# Altium schematic sheet LM-CT-001.SchDoc
size Tabloid
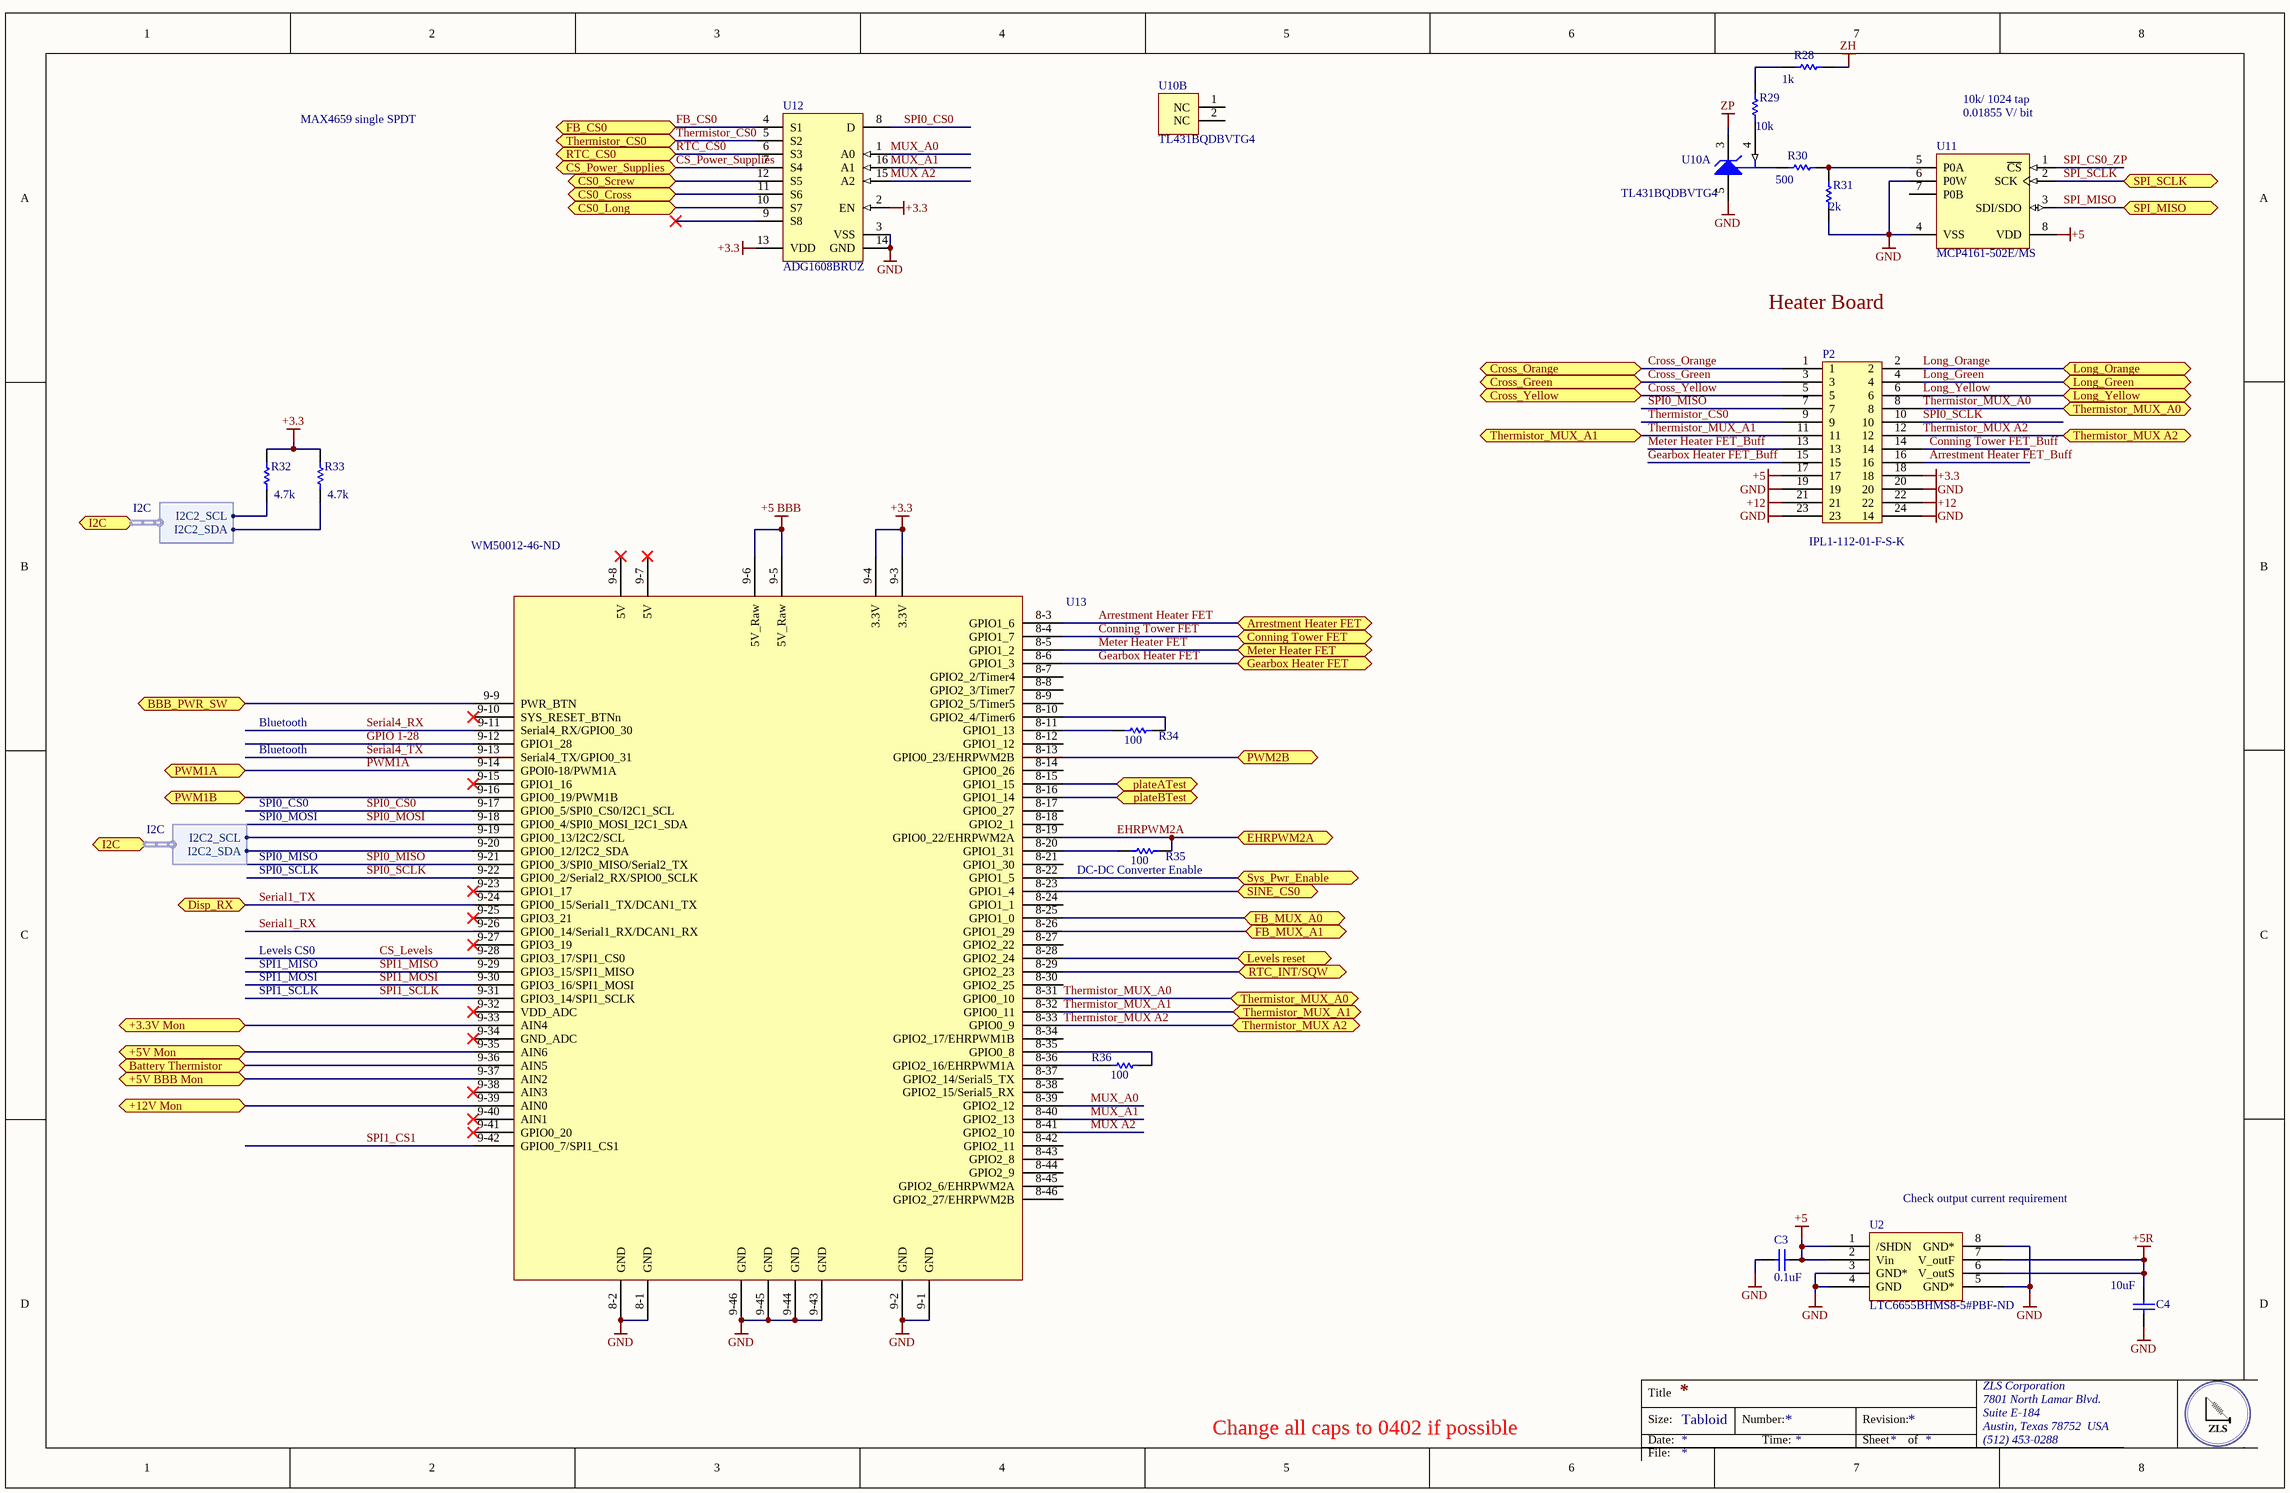
[diagram p0: LM-CT-001.SchDoc]

## Parts
C3  0.1uF  [CAPC0402(1005)60_L]
C4  value 10uF  [CAPC1812(4532)250_N]  (hidden comment: CAP FILM 10UF 20% 16VDC 1812)
P2  IPL1-112-01-F-S-K  [IPL1-112-01-F-S-K]
R28  1k  [RESC0402(1005)_M]
R29  10k  [RESC0402(1005)_M]
R30  500  [RESC0402(1005)_M]
R31  2k  [RESC0402(1005)_M]
R32  4.7k  [RESC0402(1005)_M]
R33  4.7k  [RESC0402(1005)_M]
R34  100  [RESC0402(1005)_M]
R35  100  [RESC0402(1005)_M]
R36  100  [RESC0402(1005)_M]
U2  Supplier Part Number 1: LTC6655BHMS8-5#PBF-ND  [TSOP65P490X110-8N]  (hidden comment: LTC6655BHMS8-5#PBF)
U10  TL431BQDBVTG4  [TI-DBV5_N]  (parts A,B of 2)
U11  MCP4161-502E/MS  [MSOP-MS8_N]
U12  ADG1608BRUZ  [ADI-RU-16_M]
U13  Supplier Part Number 1: WM50012-46-ND  [Beaglebone Black]  (hidden comment: BBB)

## Ports
+3.3V Mon, +5V BBB Mon, +5V Mon, +12V Mon, Arrestment Heater FET, Battery Thermistor, BBB_PWR_SW, Conning Tower FET, Cross_Green, Cross_Orange, Cross_Yellow, CS0_Cross, CS0_Long, CS0_Screw, CS_Power_Supplies, Disp_RX, EHRPWM2A, FB_CS0, FB_MUX_A0, FB_MUX_A1, Gearbox Heater FET, I2C (harness I2C), Levels reset, Long_Green, Long_Orange, Long_Yellow, Meter Heater FET, plateATest, plateBTest, PWM1A, PWM1B, PWM2B, RTC_CS0, RTC_INT/SQW, SINE_CS0, SPI_MISO, SPI_SCLK, Sys_Pwr_Enable, Thermistor_CS0, Thermistor_MUX A2, Thermistor_MUX_A0, Thermistor_MUX_A1

## Harnesses
I2C: I2C2_SDA, I2C2_SCL

## Nets
+3.3: P2.18 R32.1 R33.1 U12.2(EN) U12.13(VDD) U13.9-3(3.3V) U13.9-4(3.3V)
+5: C3.2 P2.17 U2.1(/SHDN) U2.2(Vin) U11.8(VDD)
+5 BBB: U13.9-5(5V_Raw) U13.9-6(5V_Raw)
+5R: C4.2 U2.6(V_outS) U2.7(V_outF)
+12: P2.21 P2.22
GND: C3.1 C4.1 P2.19 P2.20 P2.23 P2.24(14) R31.2 U2.3(GND*) U2.4(GND) U2.5(GND*) U2.8(GND*) U10.5(ANODE) U11.4(VSS) U11.6(P0W) U12.3(VSS) U12.14(GND) U13.8-1(GND) U13.8-2(GND) U13.9-1(GND) U13.9-2(GND) U13.9-43(GND) U13.9-44(GND) U13.9-45(GND) U13.9-46(GND)
ZH: R28.2
ZP: U10.3(CATHODE)
+3.3V Mon: U13.9-33(AIN4) ; port +3.3V Mon
+5V BBB Mon: U13.9-37(AIN2) ; port +5V BBB Mon
+5V Mon: U13.9-35(AIN6) ; port +5V Mon
+12V Mon: U13.9-39(AIN0) ; port +12V Mon
Arrestment Heater FET: U13.8-3(GPIO1_6) ; port Arrestment Heater FET
Arrestment Heater FET_Buff: P2.16
Battery Thermistor: U13.9-36(AIN5) ; port Battery Thermistor
BBB_PWR_SW: U13.9-9(PWR_BTN) ; port BBB_PWR_SW
Conning Tower FET: U13.8-4(GPIO1_7) ; port Conning Tower FET
Conning Tower FET_Buff: P2.14
Cross_Green: P2.3 ; port Cross_Green
Cross_Orange: P2.1 ; port Cross_Orange
Cross_Yellow: P2.5 ; port Cross_Yellow
CS0_Cross: U12.11(S6) ; port CS0_Cross
CS0_Long: U12.10(S7) ; port CS0_Long
CS0_Screw: U12.12(S5) ; port CS0_Screw
CS_Levels: U13.9-28(GPIO3_17/SPI1_CS0)
CS_Power_Supplies: U12.7(S4) ; port CS_Power_Supplies
EHRPWM2A: R35.2 U13.8-19(GPIO0_22/EHRPWM2A) ; port EHRPWM2A
FB_CS0: U12.4(S1) ; port FB_CS0
FB_MUX_A0: U13.8-25(GPIO1_0) ; port FB_MUX_A0
FB_MUX_A1: U13.8-26(GPIO1_29) ; port FB_MUX_A1
Gearbox Heater FET: U13.8-6(GPIO1_3) ; port Gearbox Heater FET
Gearbox Heater FET_Buff: P2.15
GPIO 1-28: U13.9-12(GPIO1_28)
Levels reset: U13.8-28(GPIO2_24) ; port Levels reset
Long_Green: P2.4 ; port Long_Green
Long_Orange: P2.2 ; port Long_Orange
Long_Yellow: P2.6 ; port Long_Yellow
Meter Heater FET: U13.8-5(GPIO1_2) ; port Meter Heater FET
Meter Heater FET_Buff: P2.13
MUX A2: U12.15(A2) U13.8-41(GPIO2_10)
MUX_A0: U12.1(A0) U13.8-39(GPIO2_12)
MUX_A1: U12.16(A1) U13.8-40(GPIO2_13)
plateATest: U13.8-15(GPIO1_15) ; port plateATest
plateBTest: U13.8-16(GPIO1_14) ; port plateBTest
PWM1A: U13.9-14(GPOI0-18/PWM1A) ; port PWM1A
PWM1B: U13.9-16(GPIO0_19/PWM1B) ; port PWM1B
PWM2B: U13.8-13(GPIO0_23/EHRPWM2B) ; port PWM2B
RTC_CS0: U12.6(S3) ; port RTC_CS0
RTC_INT/SQW: U13.8-29(GPIO2_23) ; port RTC_INT/SQW
Serial1_RX: U13.9-26(GPIO0_14/Serial1_RX/DCAN1_RX)
Serial1_TX: U13.9-24(GPIO0_15/Serial1_TX/DCAN1_TX) ; port Disp_RX
Serial4_RX: U13.9-11(Serial4_RX/GPIO0_30)
Serial4_TX: U13.9-13(Serial4_TX/GPIO0_31)
SINE_CS0: U13.8-23(GPIO1_4) ; port SINE_CS0
SPI0_CS0: U12.8(D) U13.9-17(GPIO0_5/SPI0_CS0/I2C1_SCL)
SPI0_MISO: P2.7 U13.9-21(GPIO0_3/SPI0_MISO/Serial2_TX)
SPI0_MOSI: U13.9-18(GPIO0_4/SPI0_MOSI_I2C1_SDA)
SPI0_SCLK: P2.10 U13.9-22(GPIO0_2/Serial2_RX/SPIO0_SCLK)
SPI1_CS1: U13.9-42(GPIO0_7/SPI1_CS1)
SPI1_MISO: U13.9-29(GPIO3_15/SPI1_MISO)
SPI1_MOSI: U13.9-30(GPIO3_16/SPI1_MOSI)
SPI1_SCLK: U13.9-31(GPIO3_14/SPI1_SCLK)
SPI_CS0_ZP: U11.1(~{CS})
SPI_MISO: U11.3(SDI/SDO) ; port SPI_MISO
SPI_SCLK: U11.2(SCK) ; port SPI_SCLK
Sys_Pwr_Enable: U13.8-22(GPIO1_5) ; port Sys_Pwr_Enable
Thermistor_CS0: P2.9 U12.5(S2) ; port Thermistor_CS0
Thermistor_MUX A2: P2.12 U13.8-33(GPIO0_9) ; port Thermistor_MUX A2
Thermistor_MUX_A0: P2.8 U13.8-31(GPIO0_10) ; port Thermistor_MUX_A0
Thermistor_MUX_A1: P2.11 U13.8-32(GPIO0_11) ; port Thermistor_MUX_A1
NetR28_1: R28.1 R29.1
NetR29_2: R29.2 U10.4(REF)
NetR30_2: R30.2 R31.1 U11.5(P0A)
NetR32_2: R32.2 U13.9-19(GPIO0_13/I2C2/SCL) ; port I2C.I2C2_SCL
NetR33_2: R33.2 U13.9-20(GPIO0_12/I2C2_SDA) ; port I2C.I2C2_SDA
NetR34_1: R34.1 U13.8-11(GPIO1_13)
NetR34_2: R34.2 U13.8-10(GPIO2_4/Timer6)
NetR35_1: R35.1 U13.8-20(GPIO1_31)
NetR36_1: R36.1 U13.8-36(GPIO2_16/EHRPWM1A)
NetR36_2: R36.2 U13.8-35(GPIO0_8)

Not connected (* = marked no-connect by the designer): R30 1; U10 1(NC) 2(NC); U11 7(P0B); U12 9(S8)*; U13 8-7(GPIO2_2/Timer4) 8-8(GPIO2_3/Timer7) 8-9(GPIO2_5/Timer5) 8-12(GPIO1_12) 8-14(GPIO0_26) 8-17(GPIO0_27) 8-18(GPIO2_1) 8-21(GPIO1_30) 8-24(GPIO1_1) 8-27(GPIO2_22) 8-30(GPIO2_25) 8-34(GPIO2_17/EHRPWM1B) 8-37(GPIO2_14/Serial5_TX) 8-38(GPIO2_15/Serial5_RX) 8-42(GPIO2_11) 8-43(GPIO2_8) 8-44(GPIO2_9) 8-45(GPIO2_6/EHRPWM2A) 8-46(GPIO2_27/EHRPWM2B) 9-7(5V)* 9-8(5V)* 9-10(SYS_RESET_BTNn)* 9-15(GPIO1_16)* 9-23(GPIO1_17)* 9-25(GPIO3_21)* 9-27(GPIO3_19)* 9-32(VDD_ADC)* 9-34(GND_ADC)* 9-38(AIN3)* 9-40(AIN1)* 9-41(GPIO0_20)*

## Notes on the sheet
- 10k/ 1024 tap
- MAX4659 single SPDT
- (near U11) 0.01855 V/ bit
- Heater Board
- Bluetooth
- SPI0_CS0
- SPI0_MOSI
- SPI0_MISO
- SPI0_SCLK
- (near R35) DC-DC Converter Enable
- SPI1_MISO
- Levels CS0
- SPI1_MOSI
- SPI1_SCLK
- (near U2) Check output current requirement
- Change all caps to 0402 if possible
- Title
- Size:
- Date:
- Tabloid
- Number:
- Time:
- Revision:
- Sheet
- of
- ZLS Corporation
- 7801 North Lamar Blvd.
- Suite E-184
- Austin, Texas 78752  USA
- (512) 453-0288
- File:

## Library data of the parts
C3 = CMP-1034-00252-1: CAP CER 0.1UF 10V X7R 0402; Manufacturer: Murata Electronics North America; Manufacturer Part Number: GRM155R71A104KA01D; Tolerance: ±10%; Supplier 1: Digi-Key; Supplier Part Number 1: 490-6321-1-ND; RoHS: RoHS Compliant; Category: Capacitors; Stock 1: 2920395; Pricing 1: 1=0.1, 10=0.014, 100=0.0063, 500=0.00446, 1000=0.00351, 2500=0.00319, 5000=0.00293 (USD); Packaging: Cut Tape (CT); Part Status: Active; Voltage - Rated: 10V; Temperature Coefficient: X7R; Operating Temperature: -55°C ~ 125°C; Features: -; Ratings: -; Applications: General Purpose; Mounting Type: Surface Mount, MLCC; Package / Case: 0402 (1005 Metric); Size / Dimension: 0.039" L x 0.020" W (1.00mm x 0.50mm); Height - Seated (Max): -; Thickness (Max): 0.022" (0.55mm); Lead Spacing: -; ComponentLink1URL: http://www.murata.com/~/media/webrenewal/support/library/catalog/products/capacitor/mlcc/c02e.ashx?la=en-us; ComponentLink1Description: http://www.murata.com/~/media/webrenewal/support/library/catalog/products/capacitor/mlcc/c02e.ashx?la=en-us
C4 = CMP-1040-01653-1: Manufacturer: Rubycon; Manufacturer Part Number: 16ST106MC44532; Rated Voltage: 16 V; Case-Metric: 4532; Case-EIA: 1812; Tolerance: Â±10%; Voltage Rating - DC: 16V; Dielectric Material: Acrylic, Metallized; Technology: SMT; Max Thickness: 2.5 mm; Supplier 1: Digi-Key; Supplier Part Number 1: 1189-1792-1-ND; RoHS: RoHS Compliant; Category: Capacitors; Stock 1: 1994; Pricing 1: 1=7.05, 10=6.263, 100=5.0105 (USD); Packaging: Cut Tape (CT); Part Status: Active; Voltage Rating - AC: -; Operating Temperature: -55°C ~ 125°C; Mounting Type: Surface Mount; Package / Case: 1812 (4532 Metric); Size / Dimension: 0.177" L x 0.126" W (4.50mm x 3.20mm); Height - Seated (Max): 0.102" (2.60mm); Lead Spacing: -; Applications: DC Link, DC Filtering; Features: -; ComponentLink1URL: http://www.rubycon.co.jp/en/catalog/e_pdfs/pmlcap/e_ST.pdf; ComponentLink1Description: http://www.rubycon.co.jp/en/catalog/e_pdfs/pmlcap/e_ST.pdf
P2 = IPL1-112-01-F-S-K: IPL1-112-01-F-D-K; Manufacturer: Samtec; Number of Contacts: 12; Gender: Male; Pitch: 2.54mm; Supplier 1: Newark; Supplier Part Number 1: 08W3504; Supplier 2: Avnet; Supplier Part Number 2: IPL1-112-01-F-S-K; Manufacturer Part Number: IPL1-112-01-F-S-K; Stock 2: 0; Mount: Through Hole; Packaging: Bulk; Termination: Solder; Orientation: Straight; Radiation Hardening: No; ComponentLink1URL: https://datasheet.ciiva.com/9444/ipl1-9444389.pdf; ComponentLink1Description: https://datasheet.ciiva.com/9444/ipl1-9444389.pdf
R28-R31 = CMP-1011-00463-1
R32-R36 = CMP-1011-00651-1
U2 = LTC6655BHMS8-5#PBF: Manufacturer: Linear Technology; Reference Type: Series; Output Type: Fixed; Voltage - Output (Min/Fixed): 5V; Tolerance: ±0.025%; Temperature Coefficient: 2ppm/°C; Noise - 0.1Hz to 10Hz: 0.25ppmp-p; Voltage - Input: 5.5 V ~ 13.2 V; Current - Supply: 7.5mA; Supplier 1: Digi-Key; Manufacturer Part Number: LTC6655BHMS8-5#PBF; RoHS: RoHS Compliant; Category: Integrated Circuits (ICs); Stock 1: 872; Pricing 1: 1=12.29, 25=8.158, 100=6.7 (USD); Packaging: Tube; Part Status: Active; Noise - 10Hz to 10kHz: -; Operating Temperature: -40°C ~ 125°C (TA); Mounting Type: Surface Mount; Package / Case: 8-TSSOP, 8-MSOP (0.118", 3.00mm Width); Supplier Device Package: 8-MSOP; ComponentLink1URL: http://www.linear.com/docs/28576; ComponentLink1Description: http://www.linear.com/docs/28576
U10 = CMP-0366-00713-1: Adjustable Precision Shunt Regulator, 34 ppm / degC, 100 mA, -40 to 125 degC, 5-pin SOT-23 (DBV), Green (RoHS & no Sb/Br); Manufacturer: Texas Instruments; Initial Accuracy @ 25/deg C(%): 0.5; Min Iz for Regulation(uA): 600; VO Adj(Max)(V): 36; Rating: Catalog; Temp Coeff(Typ)(ppm/ degree C): 34; VO Adj(Min)(V): 2.495; Iout/Iz(Max)(mA): 100; SubFamily: Shunt Voltage Reference; Temp Coeff(Max)(ppm/ degree C): 92; ComponentLink3Description: Package Specification; Eco-Plan: Green (RoHS & no Sb/Br); ComponentLink3URL: http://www.ti.com/litv/pdf/mpds018i; PackageDescription: 5-Pin Plastic Small Outline, Body 1.60 Ã— 2.90 mm, Pitch 0.95 mm; Mounting Technology: Surface Mount; ComponentLink2Description: Datasheet; ComponentLink1Description: Manufacturer URL; PackageVersion: 4073253-4/K; ComponentLink2URL: http://www.ti.com/general/docs/lit/getliterature.tsp?genericPartNumber=TL431B&fileType=pdf; DatasheetVersion: SLVS543M; PartNumber: TL431BQDBVTG4; ComponentLink1URL: http://www.ti.com/; Code_JEDEC: MO-178; PackageReference: DBV5; PartId: 1
U11 = CMP-0188-00907-2: 7/8-Bit Single/Dual SPI Digital POT with Non-Volatile Memory, 8-Pin MSOP, Extended Temperature; ComponentLink2Description: Datasheet; PackageDescription: 8-Lead Plastic Micro Small Outline Package (MS) [MSOP]; PackageVersion: revBB, Aug-2009; PackageReference: MSOP-MS8; ComponentLink1Description: Manufacturer URL; ComponentLink3URL: http://www.microchip.com/stellent/groups/techpub_sg/documents/packagingspec/en012702.pdf; DatasheetVersion: revB, Dec-2008; ComponentLink3Description: Package Specification; ComponentLink1URL: http://www.microchip.com/; RevisionNote: URLs added.; ComponentLink2URL: http://ww1.microchip.com/downloads/en/DeviceDoc/22059b.pdf
U12 = CMP-0793-00136-1: 4.5 Ohm Ron, 8-Channel +/-5 V,+12 V, +5 V and +3.3 V Multiplexer, 16-pin SOP (RU-16), Tube; Manufacturer: Analog Devices; Max Analog Signal Range: 0 to Vdd; Ron (ohms): 4.4; t transition (s): 150n; Bandwidth (Hz): 40M, 40M, 37M, 34M; Code_JEDEC: MO-153AB; PackageReference: RU-16; PackageDescription: 16-Pin Thin Shrink Small Outline Package, Body 5 x 4.4 mm, Pitch 0.65 mm; ComponentLink1Description: Manufacturer URL; ComponentLink2Description: Datasheet; PartNumber: ADG1608BRUZ; Mounting Technology: Surface Mount; PackageVersion: Nov-02; ComponentLink3Description: Package Specification; DatasheetVersion: Rev. 0; Packing: Tube; ComponentLink1URL: http://www.analog.com/en/index.html; ComponentLink3URL: http:/www.analog.com/static/imported-files/packages/36244347913743854010197452789RU16.pdf; ComponentLink2URL: http://www.analog.com/static/imported-files/data_sheets/ADG1608_1609.pdf
U13 = Beaglebone_Black: Beaglebone Black; Manufacturer: Molex, LLC; Manufacturer Part Number: 0010897462; Connector Type: Header, Breakaway; Pitch - Mating: 0.100" (2.54mm); Style: Board to Board or Cable; Shrouding: Unshrouded; Number of Positions: 46; Number of Positions Loaded: All; Contact Length - Mating: 0.240" (6.10mm); Contact Length - Post: 0.107" (2.71mm); Overall Contact Length: 0.437" (11.10mm); Material Flammability Rating: UL94 V-0; Supplier 1: Digi-Key; RoHS: RoHS Compliant; Category: Connectors, Interconnects; Stock 1: 407; Pricing 1: 1=7.65, 10=7.336, 25=6.698, 50=6.379, 100=6.0601, 250=5.4222, 500=5.10324 (USD); Packaging: Bulk; Part Status: Active; Contact Type: Male Pin; Number of Rows: 2; Row Spacing - Mating: 0.100" (2.54mm); Mounting Type: Through Hole; Termination: Solder; Fastening Type: -; Insulation Height: 0.090" (2.29mm); Contact Shape: Square; Contact Finish - Mating: Gold; Contact Finish Thickness - Mating: 15µin (0.38µm); Contact Finish - Post: Tin; Contact Material: Copper Alloy; Insulation Material: Liquid Crystal Polymer (LCP), Glass Filled; Features: -; Operating Temperature: -; Ingress Protection: -; Insulation Color: Black; Current Rating: -; Voltage Rating: -; Mated Stacking Heights: -; Contact Finish Thickness - Post: 74.8µin (1.90µm); Applications: Automotive, General Purpose, Lighting, Medical, Telecommunications; ComponentLink1URL: http://www.molex.com/pdm_docs/sd/010897041_sd.pdf; ComponentLink1Description: http://www.molex.com/pdm_docs/sd/010897041_sd.pdf